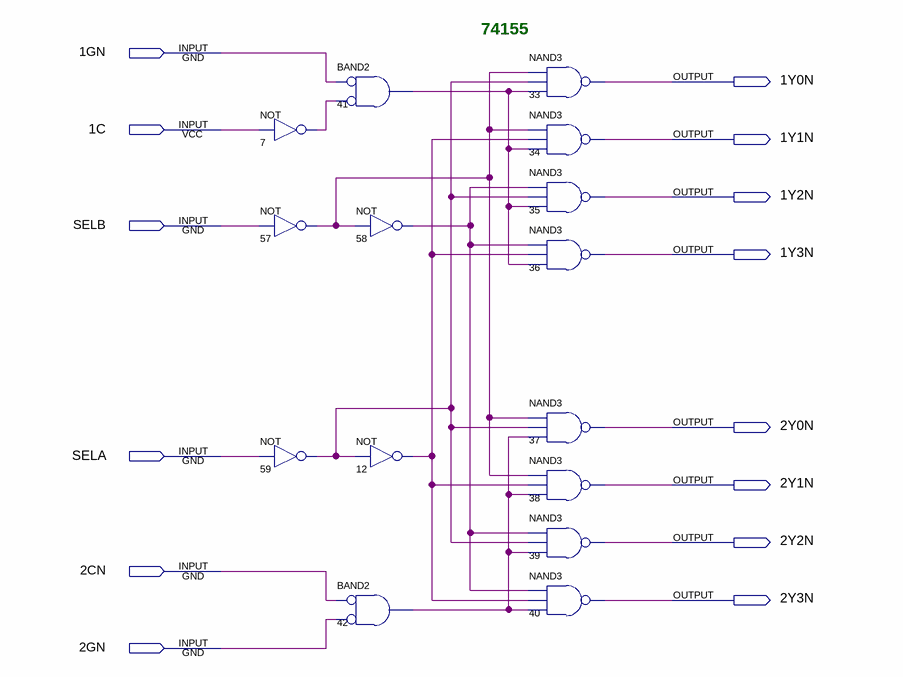
[diagram p0: schematic sheet]
// Quartus schematic 74155.bdf as structural Verilog: 15 symbols, 14 pins
module \74155  (
  input  \1GN ,
  input  \1C ,
  input  SELB,
  input  SELA,
  input  \2CN ,
  input  \2GN ,
  output \1Y0N ,
  output \1Y1N ,
  output \1Y2N ,
  output \1Y3N ,
  output \2Y0N ,
  output \2Y1N ,
  output \2Y2N ,
  output \2Y3N 
);

  wire n7_out, n12_out, n41_out, n42_out, n57_out, n58_out, n59_out;

  not u_7 (n7_out, \1C );
  not u_57 (n57_out, SELB);
  not u_59 (n59_out, SELA);
  and u_41 (n41_out, ~\1GN , ~n7_out);  // BAND2
  and u_42 (n42_out, ~\2CN , ~\2GN );  // BAND2
  not u_58 (n58_out, n57_out);
  not u_12 (n12_out, n59_out);
  nand u_33 (\1Y0N , n57_out, n59_out, n41_out);
  nand u_34 (\1Y1N , n57_out, n12_out, n41_out);
  nand u_35 (\1Y2N , n58_out, n59_out, n41_out);
  nand u_36 (\1Y3N , n58_out, n12_out, n41_out);
  nand u_37 (\2Y0N , n57_out, n59_out, n42_out);
  nand u_38 (\2Y1N , n57_out, n12_out, n42_out);
  nand u_39 (\2Y2N , n58_out, n59_out, n42_out);
  nand u_40 (\2Y3N , n58_out, n12_out, n42_out);

  // Notes on the sheet:
  //   74155
endmodule
